# EAGLE design IR_detector_perf (EAGLE 9.0.0)
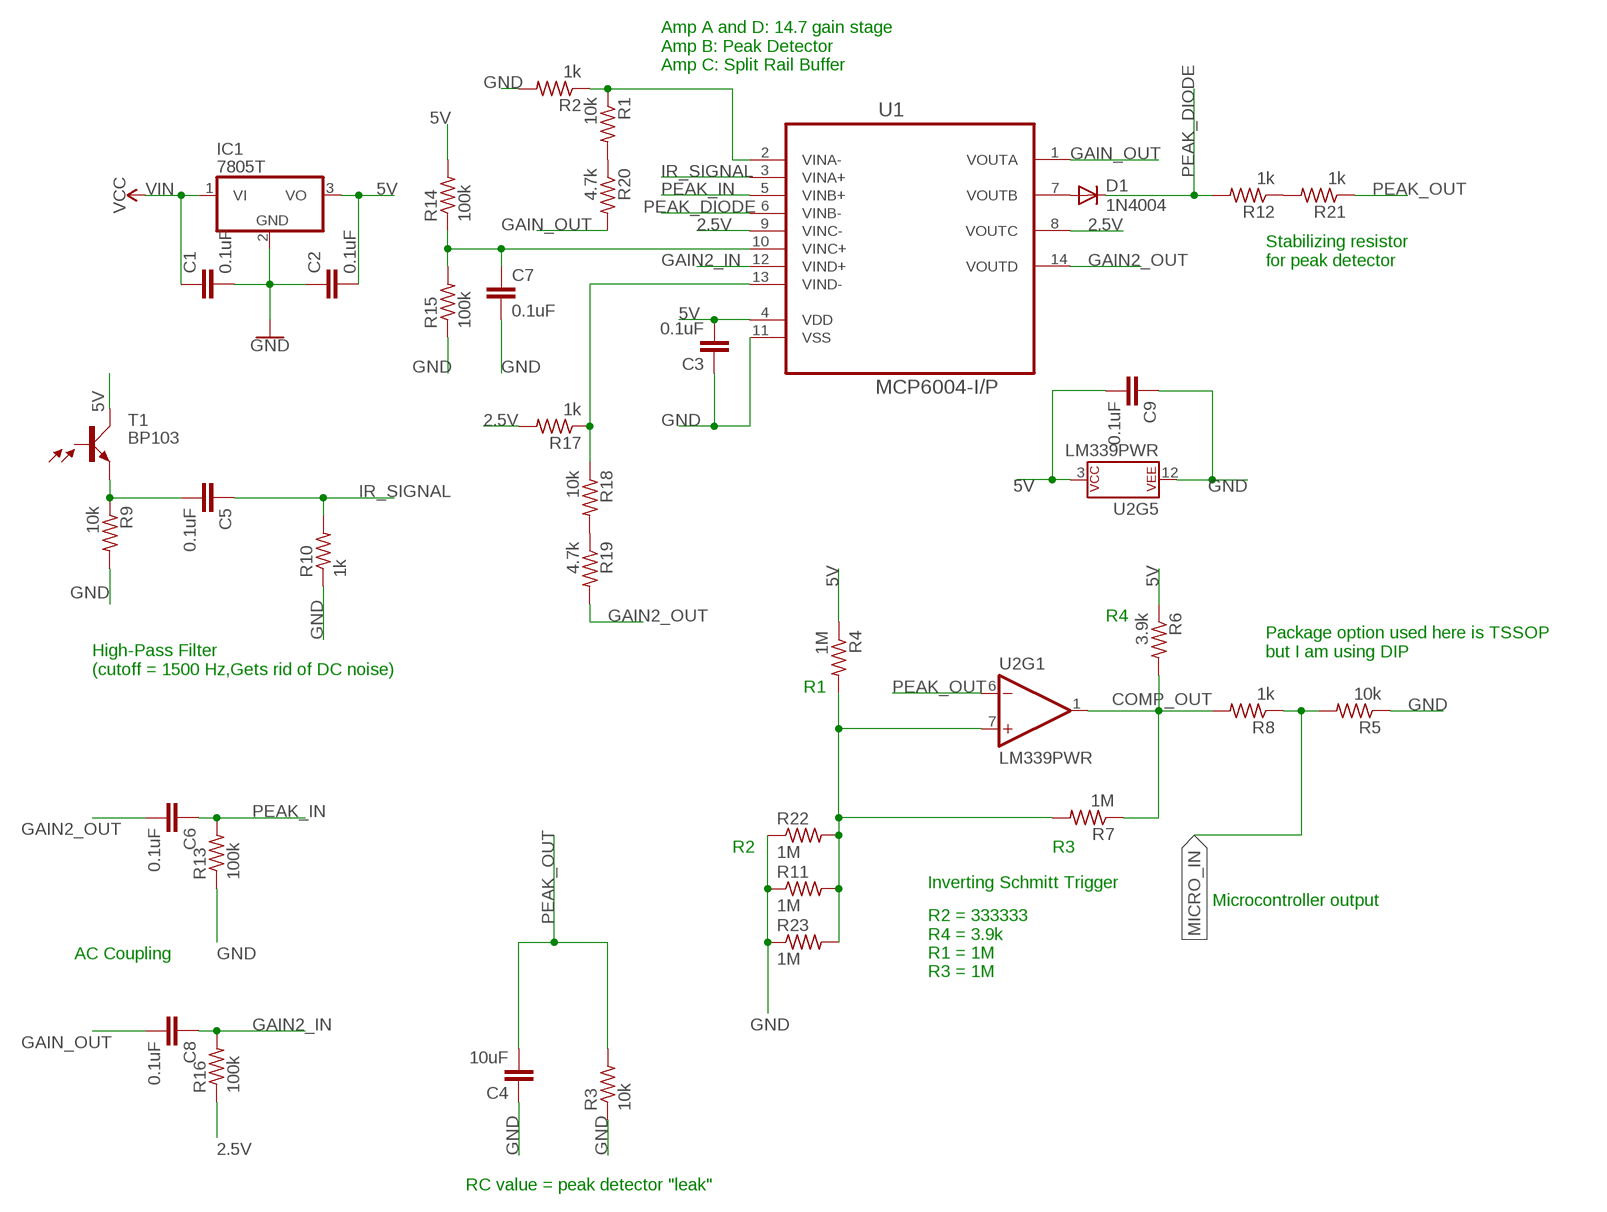
[diagram p0: schematic, sheet 1]

## Parts
C1  0.1uF  C-EU025-024X044  [C025-024X044]
C2  0.1uF  C-EU025-024X044  [C025-024X044]
C3  0.1uF  C-EU025-024X044  [C025-024X044]
C4  10uF  C-EU025-024X044  [C025-024X044]
C5  0.1uF  C-EU025-024X044  [C025-024X044]
C6  0.1uF  C-EU025-024X044  [C025-024X044]
C7  0.1uF  C-EU025-024X044  [C025-024X044]
C8  0.1uF  C-EU025-024X044  [C025-024X044]
C9  0.1uF  C-EU025-024X044  [C025-024X044]
D1  1N4004  [DO41-10]
IC1  7805T  [TO220H]
R1  10k  R-US_0204/2V  [0204V]
R2  1k  R-US_0204/2V  [0204V]
R3  10k  R-US_0204/2V  [0204V]
R4  1M  R-US_0204/2V  [0204V]
R5  10k  R-US_0204/2V  [0204V]
R6  3.9k  R-US_0204/2V  [0204V]
R7  1M  R-US_0204/2V  [0204V]
R8  1k  R-US_0204/2V  [0204V]
R9  10k  R-US_0204/2V  [0204V]
R10  1k  R-US_0204/2V  [0204V]
R11  1M  R-US_0204/2V  [0204V]
R12  1k  R-US_0204/2V  [0204V]
R13  100k  R-US_0204/2V  [0204V]
R14  100k  R-US_0204/2V  [0204V]
R15  100k  R-US_0204/2V  [0204V]
R16  100k  R-US_0204/2V  [0204V]
R17  1k  R-US_0204/2V  [0204V]
R18  10k  R-US_0204/2V  [0204V]
R19  4.7k  R-US_0204/2V  [0204V]
R20  4.7k  R-US_0204/2V  [0204V]
R21  1k  R-US_0204/2V  [0204V]
R22  1M  R-US_0204/2V  [0204V]
R23  1M  R-US_0204/2V  [0204V]
T1  BP103  [BP103]
U1  MCP6004-I/P  [DIP254P762X533-14]
U2  LM339PWR  LM339  [TSSOP-14]

## Nets
2.5V: R16.1 R17.2 U1.8(VOUTC) U1.9(VINC-)
5V: C2.2 C3.2 C9.2 IC1.3(VO) R4.1 R6.1 R14.2 T1.C U1.4(VDD) U2.3(P$V+)
COMP_OUT: R6.2 R7.1 R8.2 U2.1(OUT)
GAIN2_IN: C8.1 R16.2 U1.12(VIND+)
GAIN2_OUT: C6.2 R19.2 U1.14(VOUTD)
GAIN_OUT: C8.2 R20.2 U1.1(VOUTA)
GND: C1.2 C2.1 C3.1 C4.1 C7.2 C9.1 IC1.2(GND) R2.2 R3.1 R5.1 R9.2 R10.1 R11.1 R13.1 R15.1 R22.1 R23.1 U1.11(VSS) U2.12(P$V-)
IR_SIGNAL: C5.1 R10.2 U1.3(VINA+)
MICRO_IN: R5.2 R8.1
N$1: C5.2 R9.1 T1.E
N$2: D1.A U1.7(VOUTB)
N$3: R17.1 R18.1 U1.13(VIND-)
N$4: C7.1 R14.1 R15.2 U1.10(VINC+)
N$5: R1.1 R2.1 U1.2(VINA-)
N$6: R18.2 R19.1
N$7: R1.2 R20.1
N$8: R12.1 R21.2
N$34: R4.2 R7.2 R11.2 R22.2 R23.2 U2.7(+IN)
PEAK_DIODE: D1.C R12.2 U1.6(VINB-)
PEAK_IN: C6.1 R13.2 U1.5(VINB+)
PEAK_OUT: C4.2 R3.2 R21.1 U2.6(-IN)
VIN: C1.1 IC1.1(VI) ; supply symbol labelled VCC
Unconnected: T1.B U2.2(OUT) U2.4(-IN) U2.5(+IN) U2.8(-IN) U2.9(+IN) U2.10(-IN) U2.11(+IN) U2.13(OUT) U2.14(OUT)

## Notes on the sheet
- Amp A and D: 14.7 gain stage 
  Amp B: Peak Detector
  Amp C: Split Rail Buffer
- Stabilizing resistor 
  for peak detector
- R4
- Package option used here is TSSOP
  but I am using DIP
- High-Pass Filter
  (cutoff = 1500 Hz,Gets rid of DC noise)
- R1
- R2 | R3
- Inverting Schmitt Trigger
- Microcontroller output
- AC Coupling
- R2 = 333333
  R4 = 3.9k
  R1 = 1M
  R3 = 1M
- RC value = peak detector "leak"

## Library data of the parts
C1-C9 = resistor:C-EU: CAPACITOR, European symbol
D1 = diode:1N4004: DIODE general purpose rectifier, 1 A
IC1 = linear:78*: Positive VOLTAGE REGULATOR Source: http://cache.national.com/ds/LM/LM78L05.pdf http://www.fairchildsemi.com/ds/LM/LM7805.pdf
R1-R23 = rcl:R-US_: RESISTOR, American symbol; SPICEPREFIX: R
T1 = opto-trans-siemens:BP103: PHOTO TRANSISTOR; OC_FARNELL: unknown; OC_NEWARK: unknown
U1 = Microchip_By_element14_Batch_1:MCP6004-I/P: IC OPAMP QUAD 1.8V; MPN: MCP6004-I/P; OC_FARNELL: 1605571; OC_NEWARK: 61K2951; PACKAGE: 14DIP; SUPPLIER: Microchip
U2 = SparkFun-IC-Amplifiers:LM339: Quad Comparator - LM339PWR Based on information from the SLCS006N datasheet from TI (www.ti.com). Created by nick@scantool.net, 2008. Updated 2016. SparkFun Products SparkFun OBD-II UART <https://www.sparkfun.com/products/9555> (WIG-09555) SparkFun Car Diagnostics Kit <https://www.sparkfun.com/products/10769> (RTL-10769); PROD_ID: IC-09990

## Board
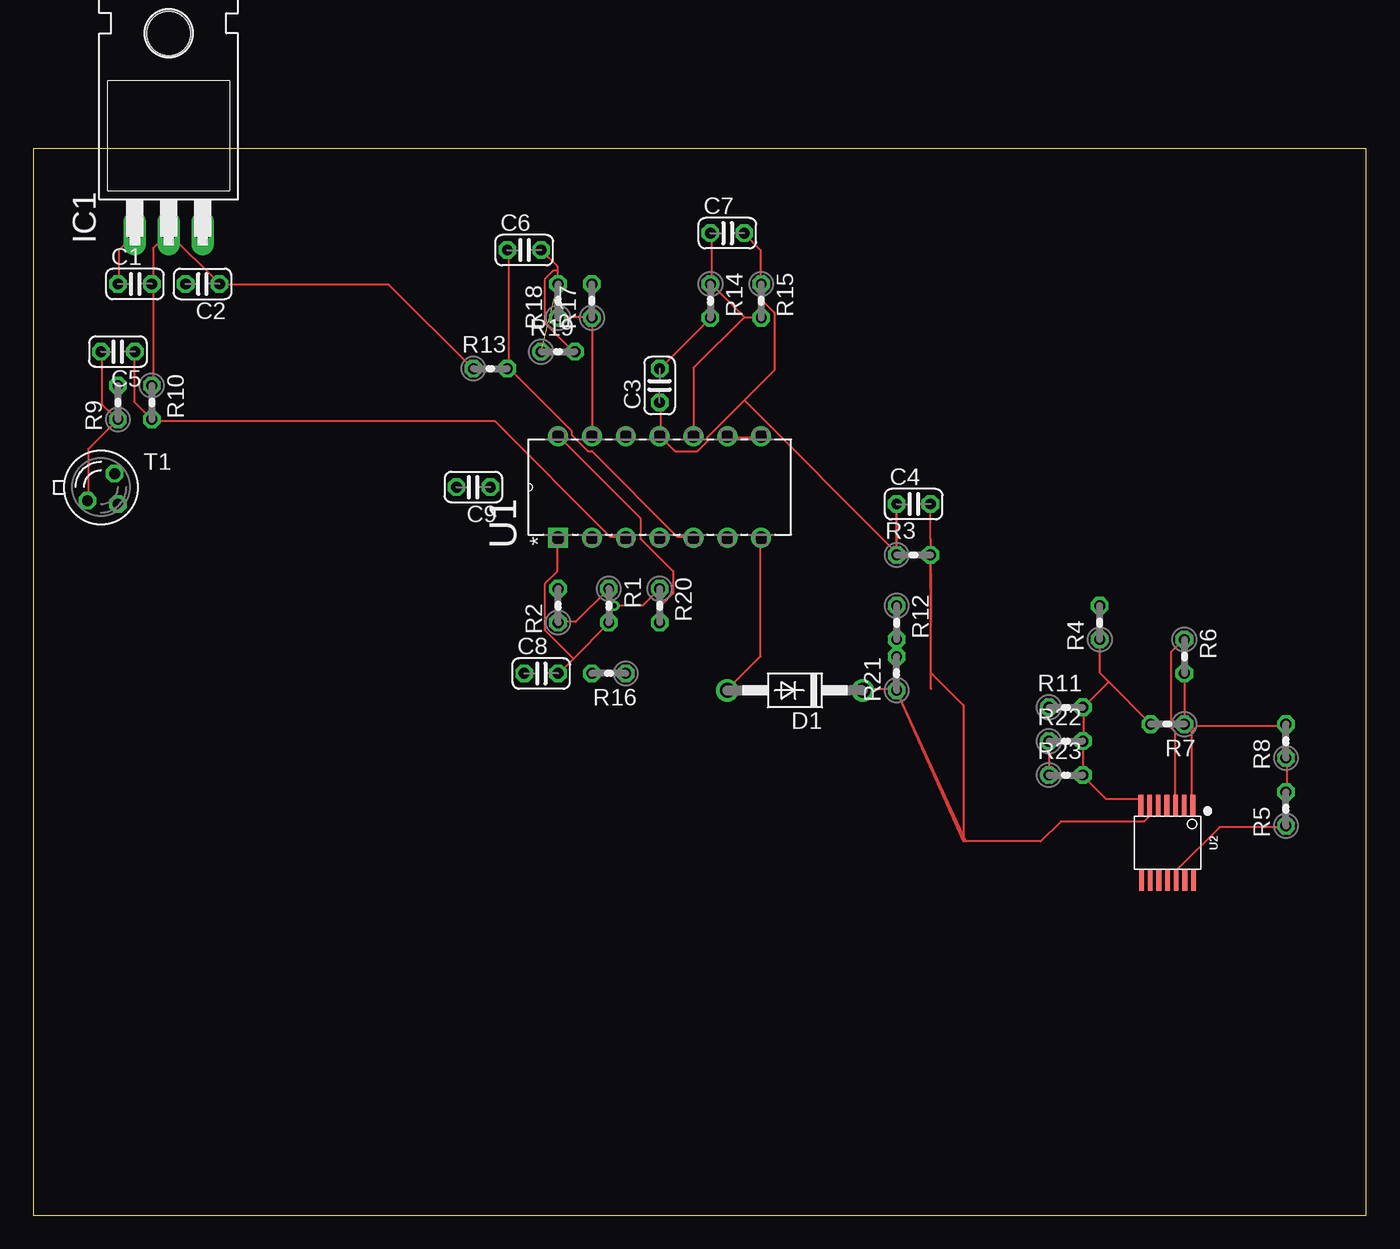
[diagram p1: board, top side]
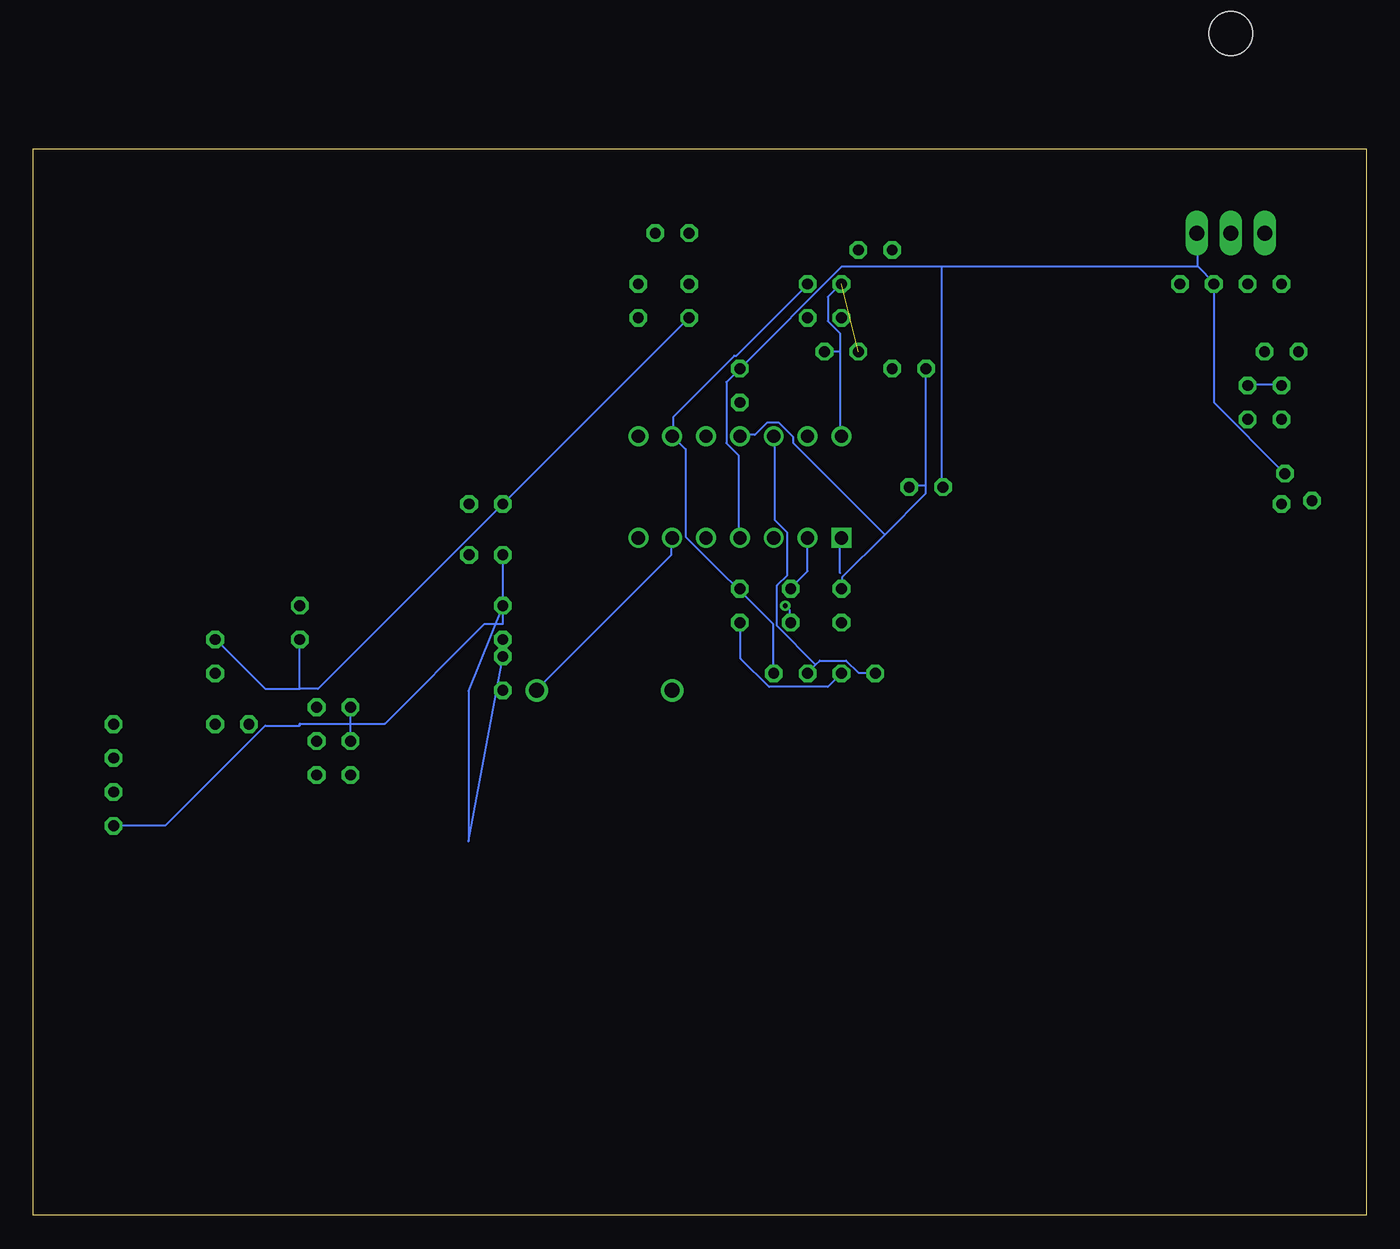
[diagram p2: board, bottom side, seen from below]

Size 100 x 80 mm. Coordinates in mm from the lower left corner, seen from the top.
Outline: 0,0 100,0 100,80 0,80 0,0
Copper layers (1*16): Top 0.035mm / dielectric 1.5mm / Bottom 0.035mm
Design rules "default": minimum track width 6mil, minimum drill 0.35mm, track to track 6mil, track to pad 6mil, pad to pad 6mil, via to via 6mil, smd to smd 6mil, copper to edge 40mil, drill to drill 6mil, minimum pad ring 10mil, minimum via ring 8mil, stop-mask expansion 4mil, vias tented up to drill 0mil, thermal gap 10mil

### Footprints (pad centres in the part's own frame; a part is rotated, then mirrored left to right if it is on the bottom)
C025-024X044 = drill 0.813 octagon: 1 -1.27,0; 2 1.27,0
DO41-10 = drill 1.118: A 5.08,0; C -5.08,0
TO220H = drill 1.118 long: 1 -2.54,-10.16; 2 0,-10.16; 3 2.54,-10.16 | hole 3.302: 0,4.826
0204V = drill 0.813 octagon: 1 -1.27,0; 2 1.27,0
BP103 = drill 0.813 octagon: B 1.27,-1.27; C 1.016,1.016; E -1.016,-1.016
DIP254P762X533-14 = drill 0.991 square: 1 -7.62,15.24 | drill 0.991: 2 -7.62,12.7; 3 -7.62,10.16; 4 -7.62,7.62; 5 -7.62,5.08; 6 -7.62,2.54; 7 -7.62,0; 8 0,0; 9 0,2.54; 10 0,5.08; 11 0,7.62; 12 0,10.16; 13 0,12.7; 14 0,15.24
TSSOP-14 = smd 1.6 x 0.35: 1 -2.8,1.9; 2 -2.8,1.25; 3 -2.8,0.6; 4 -2.8,-0.05; 5 -2.8,-0.7; 6 -2.8,-1.35; 7 -2.8,-2; 8 2.8,-1.95; 9 2.8,-1.3; 10 2.8,-0.65; 11 2.8,0; 12 2.8,0.65; 13 2.8,1.3; 14 2.8,1.95

### Placement (x,y rotation side)
C1  7.62,69.85 0 top
C2  12.7,69.85 180 top
C3  46.99,62.23 90 top
C4  66.04,53.34 0 top
C5  6.35,64.77 180 top
C6  36.83,72.39 0 top
C7  52.07,73.66 0 top
C8  38.1,40.64 0 top
C9  33.02,54.61 180 top
D1  57.15,39.37 180 top
IC1  10.16,83.82 0 top
R1  43.18,45.72 270 top
R2  39.37,45.72 90 top
R3  66.04,49.53 0 top
R4  80.01,44.45 90 top
R5  93.98,30.48 90 top
R6  86.36,41.91 270 top
R7  85.09,36.83 180 top
R8  93.98,35.56 90 top
R9  6.35,60.96 90 top
R10  8.89,60.96 270 top
R11  77.47,38.1 0 top
R12  64.77,44.45 270 top
R13  34.29,63.5 0 top
R14  50.8,68.58 270 top
R15  54.61,68.58 270 top
R16  43.18,40.64 180 top
R17  41.91,68.58 90 top
R18  39.37,68.58 90 top
R19  39.37,64.77 0 top
R20  46.99,45.72 270 top
R21  64.77,40.64 90 top
R22  77.47,35.56 0 top
R23  77.47,33.02 0 top
T1  5.08,54.61 0 top
U1  54.61,58.42 90 top
U2  85.09,27.94 270 top

### Tracks (layer width: path | path; a pad name or v marks a point on that pad's centre or on a via)
2.5V
  Top 0.152: U1.8 54.56,58.37 52.12,58.37 U1.9
  Bottom 0.152: R17.2 41.91,69.8 47.24,64.47 47.4,64.47 51.97,59.89 51.97,58.52 U1.9 51.97,58.37 51.05,57.45 51.05,50.9 44.5,44.35 44.5,40.69 R16.1
5V
  Top 0.152: U2.3 85.65,30.79 85.65,36.27 85.34,36.58 85.34,42.22 86.26,43.13 R6.1 | R14.2 50.75,67.21 47.09,63.55 C3.2
  Bottom 0.152: T1.C 11.43,60.96 C2.2 11.43,69.95 12.65,71.17 | 12.65,71.17 12.65,73.61 IC1.3 | 80.01,39.47 82.6,39.47 86.26,43.13 R6.1 | U1.4 47.09,50.9 47.09,57 48.01,57.91 48.01,62.48 C3.2 39.32,71.17 31.85,71.17 | 80.01,39.47 78.64,39.47 R14.2 | 80.01,39.47 R4.1 | 31.85,71.17 12.65,71.17 | 31.85,71.17 31.85,54.71 C9.2
COMP_OUT
  Top 0.152: 86.87,36.27 86.87,30.79 U2.1 | 86.87,36.27 86.41,36.73 R7.1 86.41,36.88 86.41,40.54 R6.2 | 86.87,36.27 87.33,36.73 93.88,36.73 R8.2
GAIN2_IN
  Bottom 0.152: 41.3,41.3 41.91,40.69 R16.2 | 41.3,41.3 41,41.6 39.01,41.6 38.1,40.69 36.88,40.69 C8.1 | 41.3,41.3 44.2,44.2 44.2,47.24 43.43,48.01 43.43,51.21 44.35,52.12 44.35,58.37 U1.12
GAIN2_OUT
  Top 0.152: 39.32,70.87 39.32,71.17 C6.2 | 39.32,70.87 39.32,69.95 | 47.09,44.5 47.09,45.72 48.01,46.63 48.01,48.31 45.57,50.75 45.57,52.27 39.47,58.37 U1.14 | 39.32,70.87 39.01,70.87 38.41,70.26 38.41,66.9 40.54,64.77 R19.2
  Bottom 0.152: 39.47,64.77 39.47,66.14 40.39,67.06 40.39,68.89 39.47,69.8 | 39.47,64.77 39.47,58.52 U1.14 | 39.47,64.77 R19.2
GAIN_OUT
  Top 0.152: 43.13,44.35 40.54,41.76 | 40.54,41.76 39.47,40.69 C8.2 | 40.54,41.76 38.41,43.89 38.41,47.4 39.32,48.31 39.32,50.75 U1.1
  Bottom 0.152: 39.47,48.16 39.47,50.75 U1.1 | C8.2 40.39,39.62 44.81,39.62 46.94,41.76 46.94,44.35 R20.2
GND
  Top 0.152: R3.1 C4.1 64.77,49.68 53.34,61.11 | U2.12 85.8,25.15 85.8,25.91 89,29.11 93.88,29.11 R5.1 | R10.1 8.99,62.33 8.99,69.8 C1.2 8.99,69.95 8.99,72.54 10.06,73.61 IC1.2 C2.1 14.02,69.8 26.67,69.8 32.92,63.55 R13.1 | C7.2 53.34,73.61 54.56,72.39 54.56,69.95 R15.1 54.71,69.8 54.71,68.58 55.63,67.67 55.63,63.4 53.34,61.11 | 53.34,61.11 50.6,58.37 50.6,58.06 49.84,57.3 48.16,57.3 47.09,58.37 U1.11 47.09,58.52 47.09,60.96 C3.1 | R22.1 R23.1
  Bottom 0.152: R5.1 93.88,29.26 90.07,29.26 82.6,36.73 80.01,36.73 80.01,36.88 76.2,36.88 | 76.2,36.88 73.61,36.88 66.14,44.35 64.77,44.35 R3.1 | R9.2 6.4,62.33 8.84,62.33 R10.1 | 36.12,51.05 33.07,54.1 33.07,54.71 | 36.12,51.05 39.32,47.85 39.32,47.09 R2.2 | 33.07,54.71 33.07,63.4 R13.1 | 36.12,51.05 42.98,57.91 42.98,58.37 44.04,59.44 44.96,59.44 45.87,58.52 46.94,58.52 U1.11 | 76.2,36.88 R11.1 | R22.1 76.2,36.88 | 33.07,54.71 34.29,54.71 C9.1
IR_SIGNAL
  Top 0.152: C5.1 7.62,60.96 R10.2 8.99,59.59 34.59,59.59 43.28,50.9 44.35,50.9 U1.3
MICRO_IN
  Top 0.152: R5.2 94.03,31.85 94.03,34.29 R8.1
N$1
  Top 0.152: T1.E 4.12,53.65 4.12,57.45 R9.1 6.25,59.74 5.18,60.81 5.18,64.77 C5.2
N$2
  Top 0.152: U1.7 54.56,50.75 54.56,41.91 52.12,39.47 D1.A
N$3
  Top 0.152: R18.1 39.47,67.36 41.91,67.36 R17.1 U1.13
N$4
  Top 0.152: 53.34,67.36 54.56,67.36 R15.2 | 53.34,67.36 50.9,69.8 R14.1 50.9,69.95 50.9,73.61 C7.1 | U1.10 49.53,63.55 53.34,67.36
N$5
  Top 0.152: R1.1 40.69,44.5 39.47,44.5 R2.1
  Bottom 0.152: U1.2 41.91,48.31 43.13,47.09 R1.1
N$6  (1 unrouted)
N$7  (via drill 0.35)
  Top 0.152: v43.59,45.72 45.72,45.72 R20.1
  Bottom 0.152: v43.59,45.72 43.28,45.41 43.28,44.5 R1.2
N$8
  Bottom 0.152: R21.2 67.36,28.04 67.36,39.32 R12.1
N$34
  Top 0.152: 83.06,31.24 83.06,30.79 U2.7 83.06,31.24 | R4.2 80.01,40.69 80.62,40.08 | 80.62,40.08 83.82,36.88 R7.2 | 78.79,38.1 78.79,35.66 R22.2 78.79,35.51 78.79,33.07 R23.2 78.79,32.92 80.47,31.24 83.06,31.24 | 78.79,38.1 80.62,39.93 80.62,40.08 | 78.79,38.1 R11.2
PEAK_DIODE
  Top 0.152: R12.2 64.77,39.47 62.33,39.47 D1.C
  Bottom 0.152: U1.6 52.12,50.75 52.12,49.53 62.18,39.47 D1.C
PEAK_IN
  Top 0.152: 35.66,63.55 35.66,72.39 C6.1 | 35.66,63.55 40.39,58.83 40.39,58.52 41.6,57.3 41.91,57.3 48.31,50.9 49.53,50.9 U1.5 | 35.66,63.55 R13.2
PEAK_OUT
  Top 0.152: C4.2 67.36,48.16 67.36,44.5 R3.2 67.36,44.35 67.36,40.69 | U2.6 83.67,30.63 83.67,29.87 83.36,29.57 77.11,29.57 75.59,28.04 69.95,28.04 R21.1 69.8,28.04 69.8,38.25 67.36,40.69 | 67.36,39.47 67.36,40.69
VIN
  Top 0.152: C1.1 6.4,69.95 6.4,72.39 7.62,73.61 IC1.1